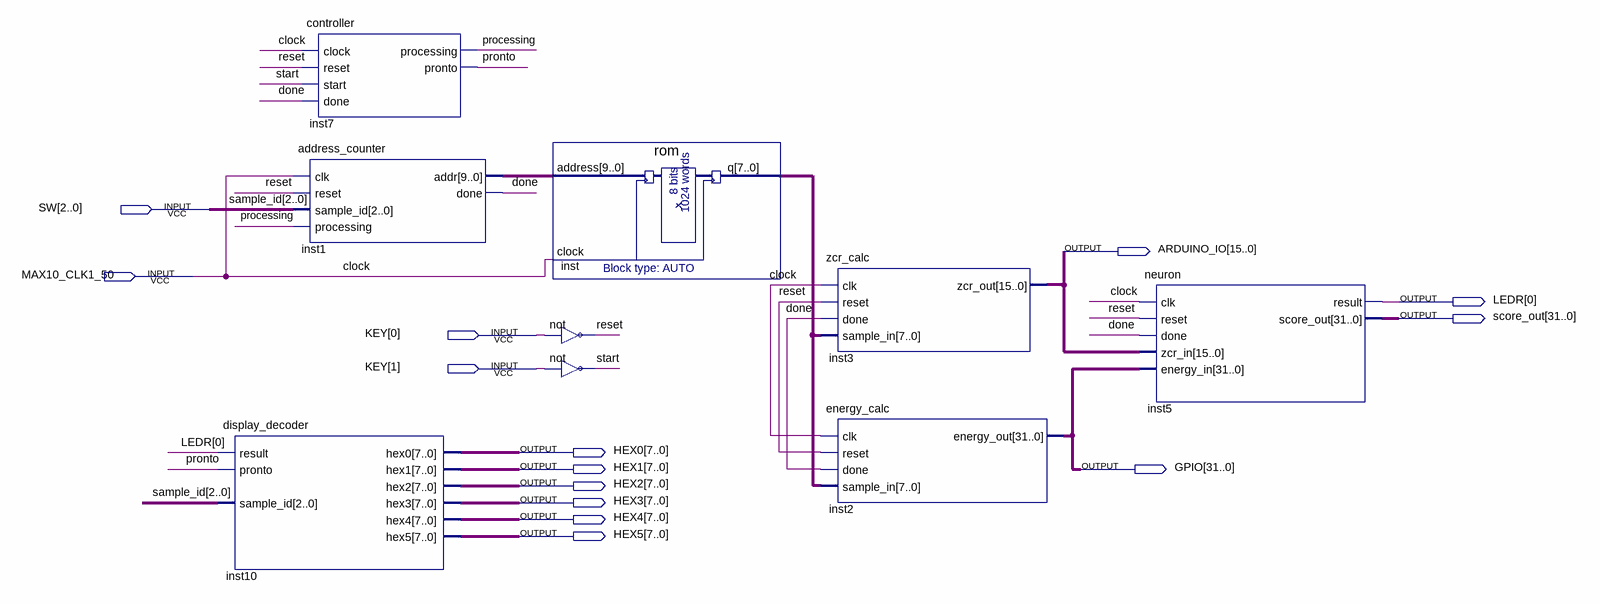
[diagram p0: schematic sheet]
// Quartus schematic perceptron.bdf as structural Verilog: 9 symbols, 14 pins
module perceptron (
  input  [2:0] SW,
  input  MAX10_CLK1_50,
  input  [1:0] KEY,
  output [15:0] ARDUINO_IO,
  output [0:0] LEDR,
  output [31:0] score_out,
  output [7:0] HEX0,
  output [7:0] HEX1,
  output [31:0] GPIO,
  output [7:0] HEX2,
  output [7:0] HEX3,
  output [7:0] HEX4,
  output [7:0] HEX5
);

  wire done, processing, pronto, reset, start;
  wire [7:0] inst_q;
  wire [9:0] inst1_addr;

  display_decoder inst10 (
    .result(LEDR[0]), .pronto(pronto), .sample_id(SW), .hex0(HEX0), .hex1(HEX1), .hex2(HEX2), .hex3(HEX3),
    .hex4(HEX4), .hex5(HEX5));
  controller inst7 (
    .clock(MAX10_CLK1_50), .reset(reset), .start(start), .done(done), .processing(processing), .pronto(pronto));
  address_counter inst1 (
    .clk(MAX10_CLK1_50), .reset(reset), .sample_id(SW), .processing(processing), .addr(inst1_addr),
    .done(done));
  rom inst (.address(inst1_addr), .clock(MAX10_CLK1_50), .q(inst_q));
  not inst8 (reset, KEY[0]);
  not inst9 (start, KEY[1]);
  zcr_calc inst3 (.clk(MAX10_CLK1_50), .reset(reset), .done(done), .sample_in(inst_q), .zcr_out(ARDUINO_IO));
  energy_calc inst2 (.clk(MAX10_CLK1_50), .reset(reset), .done(done), .sample_in(inst_q), .energy_out(GPIO));
  neuron inst5 (
    .clk(MAX10_CLK1_50), .reset(reset), .done(done), .zcr_in(ARDUINO_IO), .energy_in(GPIO), .result(LEDR[0]),
    .score_out(score_out));

  // Other names for the same wires on the sheet: clock = MAX10_CLK1_50; sample_id[2:0] = SW
endmodule
